# EAGLE design Shematic (EAGLE 8.6.3)
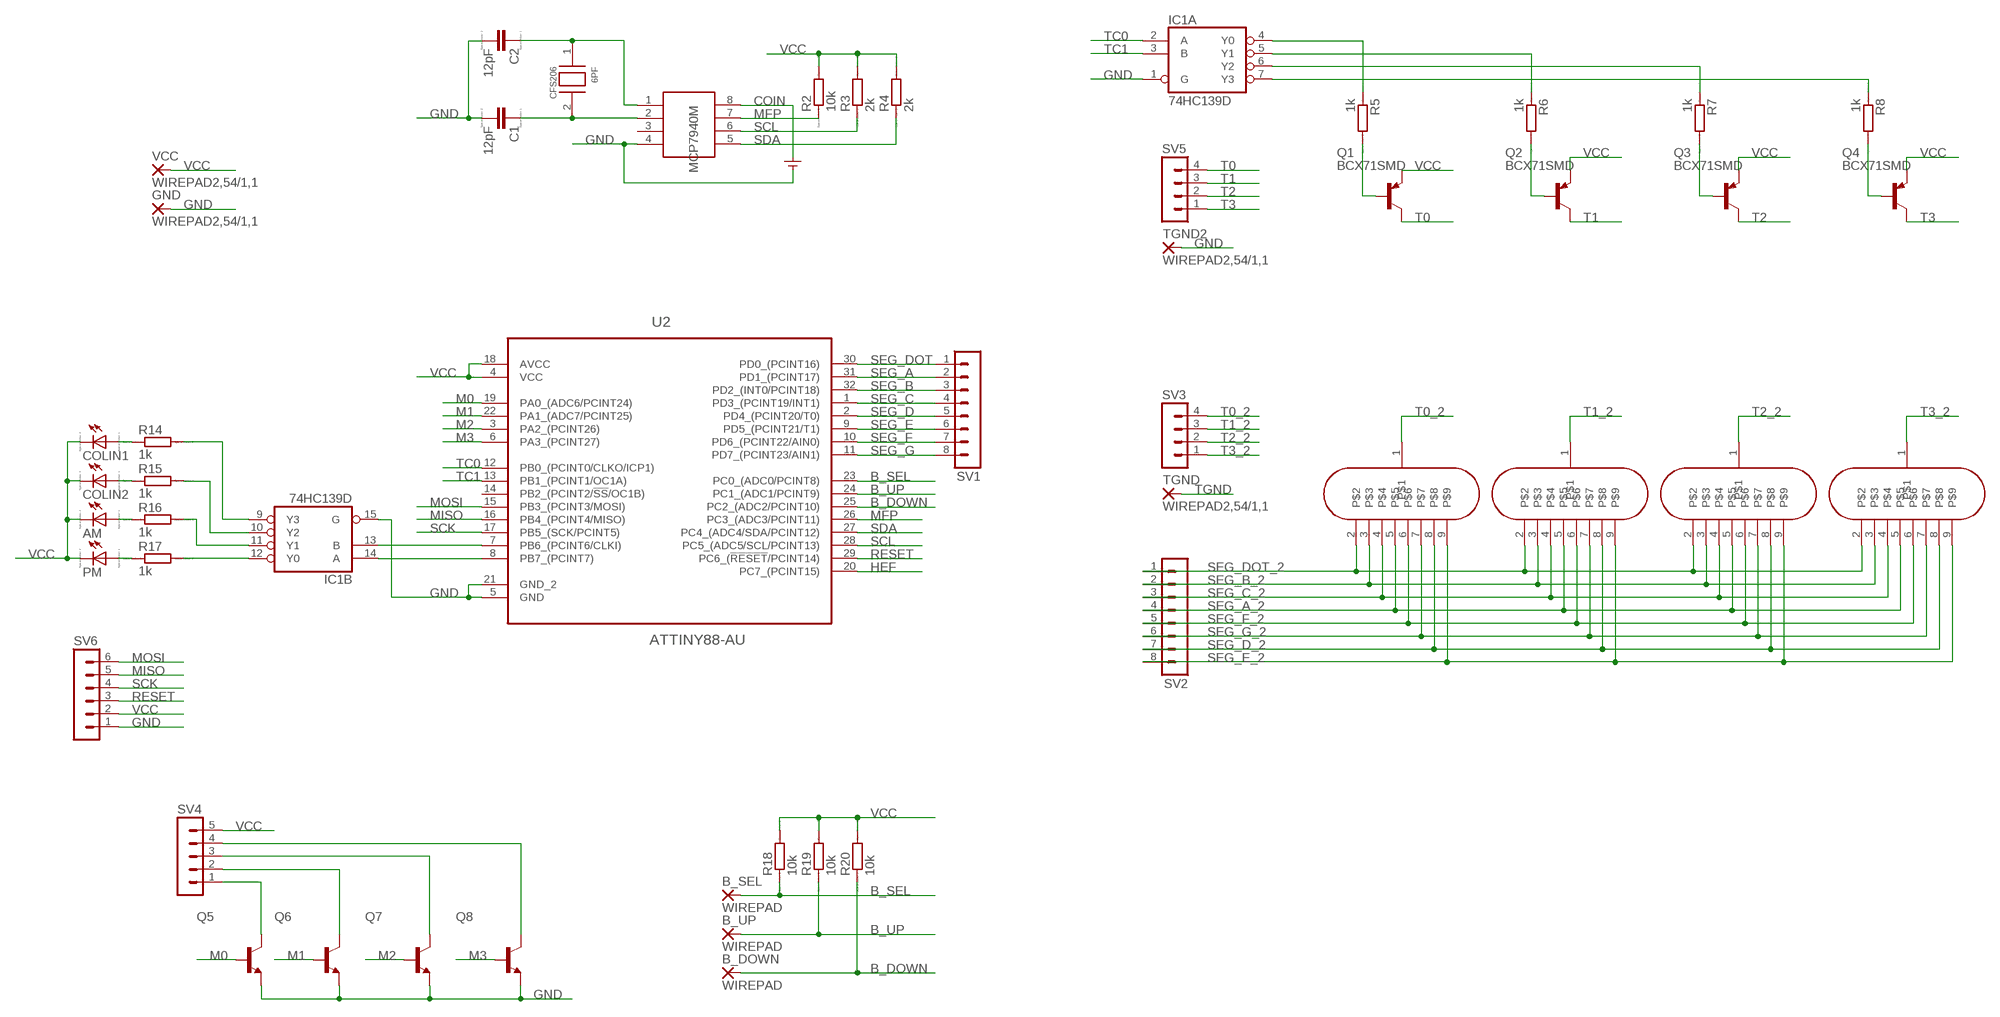
[diagram p0: schematic, sheet 1]

## Parts
6PF  CFS206  [CFS206]
AM  LED_ELD260  [LED_LD260]
B_DOWN  WIREPAD  WIREPAD2,54/1,1  [2,54/1,1]
B_SEL  WIREPAD  WIREPAD2,54/1,1  [2,54/1,1]
B_UP  WIREPAD  WIREPAD2,54/1,1  [2,54/1,1]
C1  12pF  CC1206  [C1206]
C2  12pF  CC1206  [C1206]
COLIN1  LED_ELD260  [LED_LD260]
COLIN2  LED_ELD260  [LED_LD260]
GND  WIREPAD2,54/1,1  [2,54/1,1]
IC1  74HC139D  [SO16]
MCP7940M  SOIC-8  [SOIC-8]
PM  LED_ELD260  [LED_LD260]
Q1  BCX71SMD  [SOT23]
Q2  BCX71SMD  [SOT23]
Q3  BCX71SMD  [SOT23]
Q4  BCX71SMD  [SOT23]
Q5  BCX70SMD  [SOT23]
Q6  BCX70SMD  [SOT23]
Q7  BCX70SMD  [SOT23]
Q8  BCX70SMD  [SOT23]
R2  10k  RR1206  [R1206]
R3  2k  RR1206  [R1206]
R4  2k  RR1206  [R1206]
R5  1k  RR1206  [R1206]
R6  1k  RR1206  [R1206]
R7  1k  RR1206  [R1206]
R8  1k  RR1206  [R1206]
R14  1k  RR1206  [R1206]
R15  1k  RR1206  [R1206]
R16  1k  RR1206  [R1206]
R17  1k  RR1206  [R1206]
R18  10k  RR1206  [R1206]
R19  10k  RR1206  [R1206]
R20  10k  RR1206  [R1206]
SV1  MA08-1  [MA08-1]
SV2  MA08-1  [MA08-1]
SV3  MA04-1  [MA04-1]
SV4  MA05-1  [MA05-1]
SV5  MA04-1  [MA04-1]
SV6  MA06-1  [MA06-1]
TGND  WIREPAD2,54/1,1  [2,54/1,1]
TGND2  WIREPAD2,54/1,1  [2,54/1,1]
TUBE0  IV-9  [IV-9]
TUBE1  IV-9  [IV-9]
TUBE2  IV-9  [IV-9]
TUBE3  IV-9  [IV-9]
U2  ATTINY88-AU  [QFP80P900X900X120-32N]
U$5  COIN  [COIN]
VCC  WIREPAD2,54/1,1  [2,54/1,1]

## Nets
B_DOWN: B_DOWN.1(P) R20.1 U2.25(PC2_(ADC2/PCINT10))
B_SEL: B_SEL.1(P) R18.1 U2.23(PC0_(ADC0/PCINT8))
B_UP: B_UP.1(P) R19.1 U2.24(PC1_(ADC1/PCINT9))
COIN: MCP7940M.8 U$5.V+
GND: C1.2 C2.2 GND.1(P) IC1.1(A:G) IC1.15(B:G) MCP7940M.4 Q5.2(E) Q6.2(E) Q7.2(E) Q8.2(E) SV6.1 TGND2.1(P) U2.5(GND) U2.21(GND_2) U$5.V-
HEF: U2.20(PC7_(PCINT15))
M0: Q5.1(B) U2.19(PA0_(ADC6/PCINT24))
M1: Q6.1(B) U2.22(PA1_(ADC7/PCINT25))
M2: Q7.1(B) U2.3(PA2_(PCINT26))
M3: Q8.1(B) U2.6(PA3_(PCINT27))
MFP: MCP7940M.7 R2.1 U2.26(PC3_(ADC3/PCINT11))
MISO: SV6.5 U2.16(PB4_(PCINT4/MISO))
MOSI: SV6.6 U2.15(PB3_(PCINT3/MOSI))
N$1: Q4.1(B) R8.2
N$2: Q3.1(B) R7.2
N$3: Q2.1(B) R6.2
N$4: 6PF.2 C1.1 MCP7940M.2
N$5: Q1.1(B) R5.2
N$6: 6PF.1 C2.1 MCP7940M.1
N$7: COLIN1.A R14.1
N$8: IC1.4(A:Y0) R5.1
N$9: COLIN2.A R15.1
N$10: IC1.5(A:Y1) R6.1
N$11: IC1.6(A:Y2) R7.1
N$12: AM.A R16.1
N$13: IC1.7(A:Y3) R8.1
N$14: PM.A R17.1
N$15: IC1.12(B:Y0) R17.2
N$16: IC1.11(B:Y1) R16.2
N$17: IC1.10(B:Y2) R15.2
N$18: IC1.9(B:Y3) R14.2
N$19: Q5.3(C) SV4.1
N$20: Q6.3(C) SV4.2
N$21: Q7.3(C) SV4.3
N$22: Q8.3(C) SV4.4
N$27: IC1.13(B:B) U2.7(PB6_(PCINT6/CLKI))
N$28: IC1.14(B:A) U2.8(PB7_(PCINT7))
RESET: SV6.3 U2.29(PC6_(!RESET!/PCINT14))
SCK: SV6.4 U2.17(PB5_(SCK/PCINT5))
SCL: MCP7940M.6 R3.1 U2.28(PC5_(ADC5/SCL/PCINT13))
SDA: MCP7940M.5 R4.1 U2.27(PC4_(ADC4/SDA/PCINT12))
SEG_A: SV1.2 U2.31(PD1_(PCINT17))
SEG_A_2: SV2.4 TUBE0.5 TUBE1.5 TUBE2.5 TUBE3.5
SEG_B: SV1.3 U2.32(PD2_(INT0/PCINT18))
SEG_B_2: SV2.2 TUBE0.3 TUBE1.3 TUBE2.3 TUBE3.3
SEG_C: SV1.4 U2.1(PD3_(PCINT19/INT1))
SEG_C_2: SV2.3 TUBE0.4 TUBE1.4 TUBE2.4 TUBE3.4
SEG_D: SV1.5 U2.2(PD4_(PCINT20/T0))
SEG_D_2: SV2.7 TUBE0.8 TUBE1.8 TUBE2.8 TUBE3.8
SEG_DOT: SV1.1 U2.30(PD0_(PCINT16))
SEG_DOT_2: SV2.1 TUBE0.2 TUBE1.2 TUBE2.2 TUBE3.2
SEG_E: SV1.6 U2.9(PD5_(PCINT21/T1))
SEG_E_2: SV2.8 TUBE0.9 TUBE1.9 TUBE2.9 TUBE3.9
SEG_F: SV1.7 U2.10(PD6_(PCINT22/AIN0))
SEG_F_2: SV2.5 TUBE0.6 TUBE1.6 TUBE2.6 TUBE3.6
SEG_G: SV1.8 U2.11(PD7_(PCINT23/AIN1))
SEG_G_2: SV2.6 TUBE0.7 TUBE1.7 TUBE2.7 TUBE3.7
T0: Q1.3(C) SV5.4
T0_2: SV3.4 TUBE0.1
T1: Q2.3(C) SV5.3
T1_2: SV3.3 TUBE1.1
T2: Q3.3(C) SV5.2
T2_2: SV3.2 TUBE2.1
T3: Q4.3(C) SV5.1
T3_2: SV3.1 TUBE3.1
TC0: IC1.2(A:A) U2.12(PB0_(PCINT0/CLKO/ICP1))
TC1: IC1.3(A:B) U2.13(PB1_(PCINT1/OC1A))
TGND: TGND.1(P)
VCC: AM.K(C) COLIN1.K(C) COLIN2.K(C) PM.K(C) Q1.2(E) Q2.2(E) Q3.2(E) Q4.2(E) R2.2 R3.2 R4.2 R18.2 R19.2 R20.2 SV4.5 SV6.2 U2.4(VCC) U2.18(AVCC) VCC.1(P)
Unconnected: MCP7940M.3 U2.14(PB2_(PCINT2/!SS!/OC1B))

## Power pins joined to a net without a drawn wire
GND: IC1.8(P:GND)
VCC: IC1.16(P:VCC)

## Library data of the parts
6PF = Library:CFS206
AM COLIN1 COLIN2 PM = eagle-ltspice:LED_E: LED Source: http://www.osram.convergy.de Source: www.luxeon.com Source: www.kingbright.com; SPICEMODEL: NONE; SPICEPREFIX: D; SPICETYPE: diode
B_DOWN B_SEL B_UP GND TGND TGND2 VCC = wirepad:WIREPAD: Wire PAD connect wire on PCB
C1 C2 = eagle-ltspice:C: CAPACITOR, European symbol; SPICEMODEL: NONE; SPICEPREFIX: C
IC1 = 74xx-eu:74*139: Dual 2-line to 4-line DECODER/DEMULTIPLEXER
MCP7940M = smd-footprints:SOIC-8
Q1-Q4 = transistor-pnp:BCX71SMD: PNP Transistor
Q5-Q8 = transistor-npn:BCX70*: NPN Transistor
R2-R8 R14-R20 = eagle-ltspice:R: RESISTOR, European symbol; SPICEMODEL: NONE; SPICEPREFIX: R
SV1 SV2 = con-lstb:MA08-1: PIN HEADER; OC_FARNELL: unknown; OC_NEWARK: unknown
SV3 SV5 = con-lstb:MA04-1: PIN HEADER; OC_FARNELL: unknown; OC_NEWARK: unknown
SV4 = con-lstb:MA05-1: PIN HEADER; OC_FARNELL: unknown; OC_NEWARK: unknown
SV6 = con-lstb:MA06-1: PIN HEADER; OC_FARNELL: unknown; OC_NEWARK: unknown
TUBE0 TUBE1-TUBE3 = Library:IV-9
U2 = Library:ATTINY88-AU: IC, 8BIT MCU, AVR Tiny, 12MHZ, TQFP-32; MPN: ATTINY88-AU; OC_FARNELL: 1704570; OC_NEWARK: 68T3851; PACKAGE: TQFP-32; SUPPLIER: ATMEL
U$5 = Library:COIN

## Board
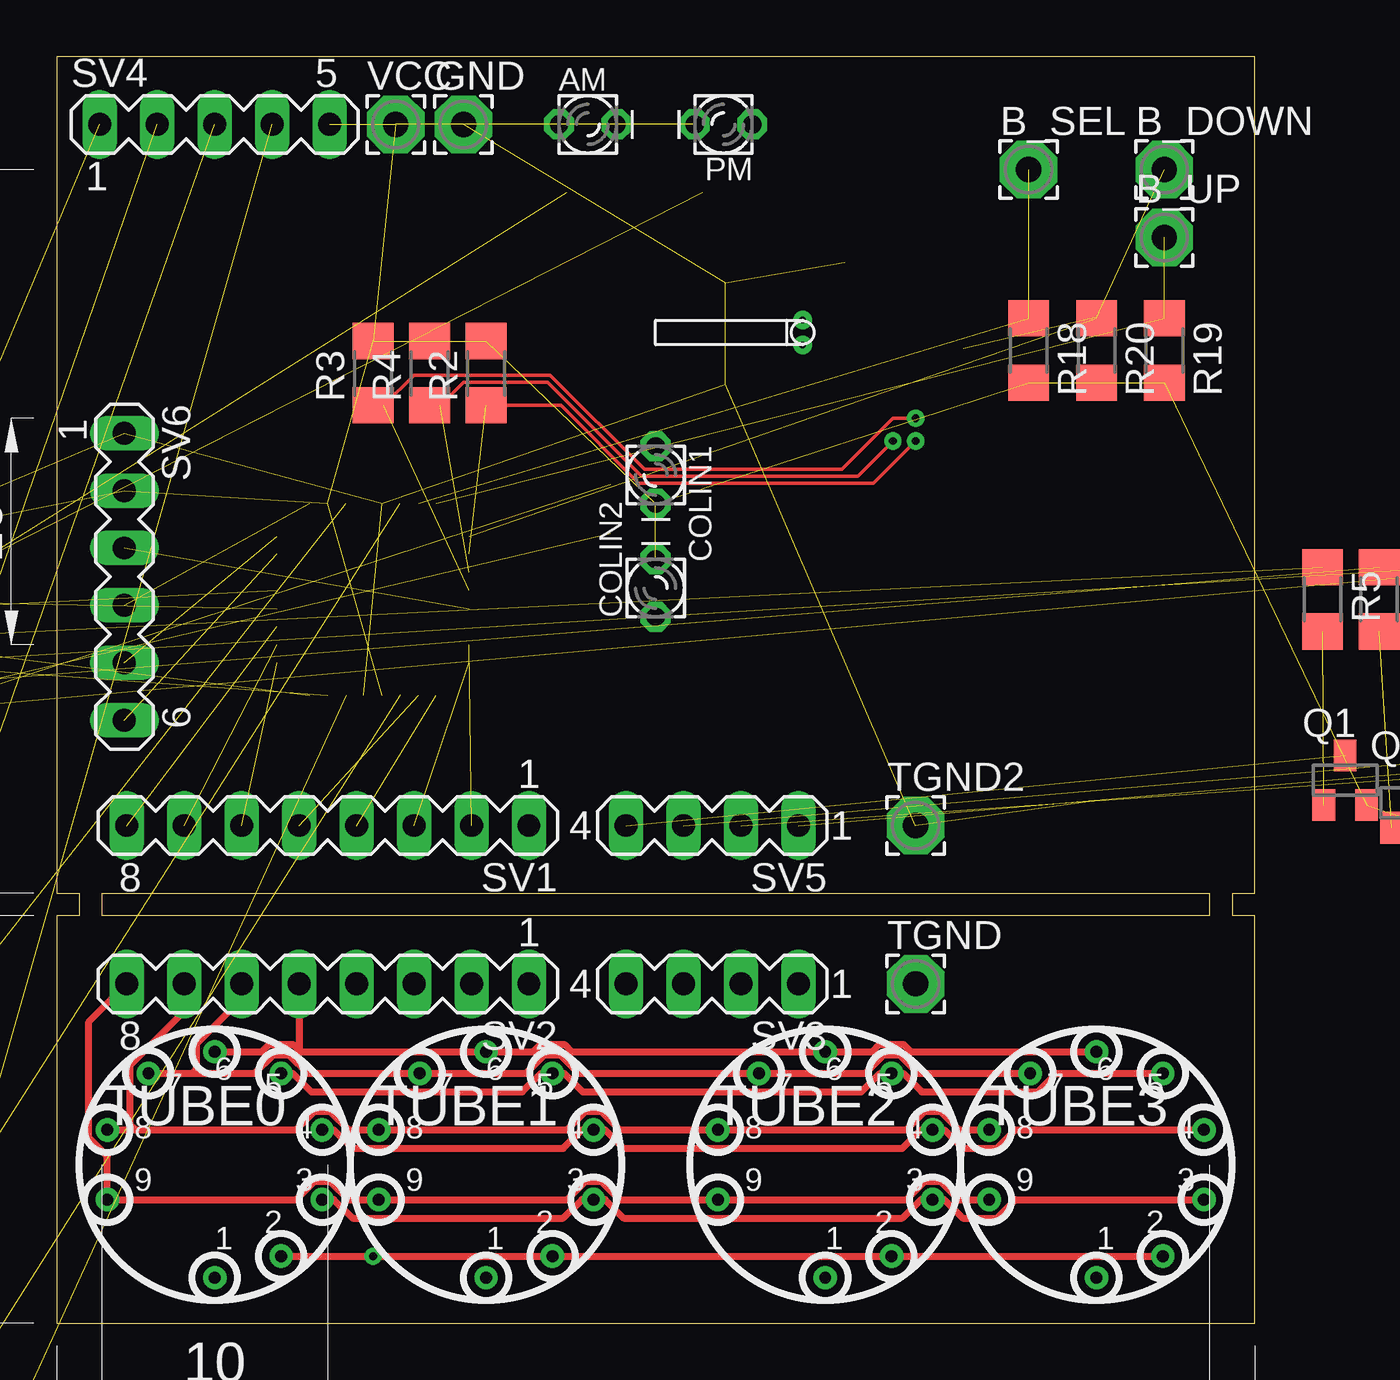
[diagram p1: board, top side]
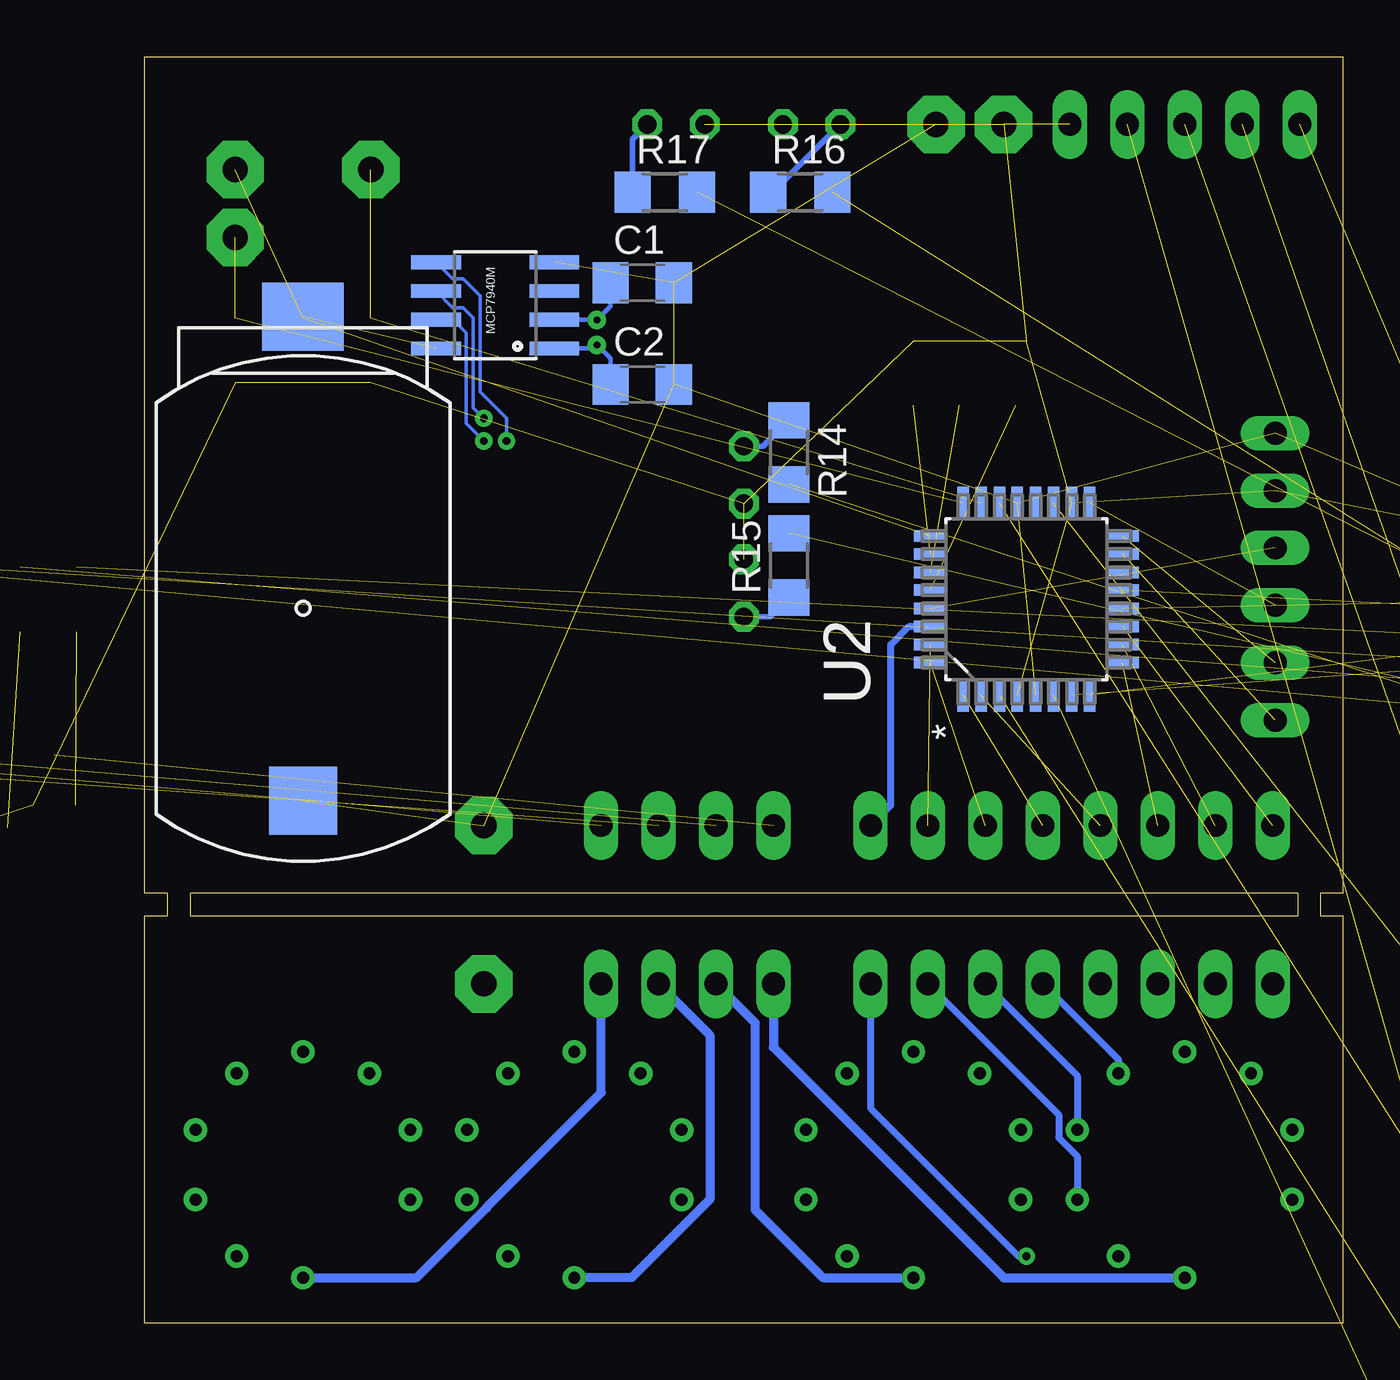
[diagram p2: board, bottom side, seen from below]

Size 53 x 56 mm. Coordinates in mm from the lower left corner, seen from the top.
Outline: 0,0 53,0 53,18 52,18 52,19 53,19 53,56 0,56 0,19 1,19 1,18 0,18 0,0
Outline: 51,18 2,18 2,19 51,19 51,18
Copper layers (1*16): Top 0.035mm / dielectric 1.5mm / Bottom 0.035mm
Design rules "default": minimum track width 6mil, minimum drill 0.35mm, track to track 6mil, track to pad 6mil, pad to pad 6mil, via to via 6mil, smd to smd 6mil, copper to edge 40mil, drill to drill 6mil, minimum pad ring 10mil, minimum via ring 8mil, stop-mask expansion 4mil, vias tented up to drill 0mil, thermal gap 10mil
Holes 3 mm at 100,-6 100,20

### Footprints (pad centres in the part's own frame; a part is rotated, then mirrored left to right if it is on the bottom)
CFS206 = drill 0.3: 1 0,0; 2 1.1,0
LED_LD260 = drill 0.813 octagon: A -1.27,0; K 1.27,0
2,54/1,1 = drill 1.118 pad 2.54 octagon: 1 0,0
C1206 = smd 1.6 x 1.8: 1 -1.4,0; 2 1.4,0
SO16 = smd 0.66 x 2.032: 1 -4.445,-3.073; 2 -3.175,-3.073; 3 -1.905,-3.073; 4 -0.635,-3.073; 5 0.635,-3.073; 6 1.905,-3.073; 7 3.175,-3.073; 8 4.445,-3.073; 9 4.445,3.073; 10 3.175,3.073; 11 1.905,3.073; 12 0.635,3.073; 13 -0.635,3.073; 14 -1.905,3.073; 15 -3.175,3.073; 16 -4.445,3.073
SOIC-8 = smd 0.61 x 2.21: 1 -1.905,-2.616; 2 -0.635,-2.616; 3 0.635,-2.616; 4 1.905,-2.616; 5 1.905,2.616; 6 0.635,2.616; 7 -0.635,2.616; 8 -1.905,2.616
SOT23 = smd 1 x 1.4: 1 -0.95,-1.1; 2 0.95,-1.1; 3 0,1.1
R1206 = smd 1.6 x 1.803: 1 -1.422,0; 2 1.422,0
MA08-1 = drill 1.016 long: 1 -8.89,0; 2 -6.35,0; 3 -3.81,0; 4 -1.27,0; 5 1.27,0; 6 3.81,0; 7 6.35,0; 8 8.89,0
MA04-1 = drill 1.016 long: 1 -3.81,0; 2 -1.27,0; 3 1.27,0; 4 3.81,0
MA05-1 = drill 1.016 long: 1 -5.08,0; 2 -2.54,0; 3 0,0; 4 2.54,0; 5 5.08,0
MA06-1 = drill 1.016 long: 1 -6.35,0; 2 -3.81,0; 3 -1.27,0; 4 1.27,0; 5 3.81,0; 6 6.35,0
IV-9 = drill 0.525: 1 0,-4.994; 2 2.936,-4.041; 3 4.75,-1.543; 4 4.75,1.543; 5 2.936,4.041; 6 0,4.994; 7 -2.936,4.041; 8 -4.75,1.543; 9 -4.75,-1.543
QFP80P900X900X120-32N = smd 1.473 x 0.508: 1 -4.242,2.794; 2 -4.242,2.007; 3 -4.242,1.194; 4 -4.242,0.406; 5 -4.242,-0.406; 6 -4.242,-1.194; 7 -4.242,-2.007; 8 -4.242,-2.794; 17 4.242,-2.794; 18 4.242,-2.007; 19 4.242,-1.194; 20 4.242,-0.406; 21 4.242,0.406; 22 4.242,1.194; 23 4.242,2.007; 24 4.242,2.794 | smd 0.508 x 1.473: 9 -2.794,-4.242; 10 -2.007,-4.242; 11 -1.194,-4.242; 12 -0.406,-4.242; 13 0.406,-4.242; 14 1.194,-4.242; 15 2.007,-4.242; 16 2.794,-4.242; 25 2.794,4.242; 26 2.007,4.242; 27 1.194,4.242; 28 0.406,4.242; 29 -0.406,4.242; 30 -1.194,4.242; 31 -2.007,4.242; 32 -2.794,4.242
COIN = smd 3.6 x 3: V+ 0,-1.5 | smd 3 x 3: V- 0,19.9

### Placement (x,y rotation side)
6PF  33,43.25 90 top
AM  23.5,53 0 top
B_DOWN  49,51 0 top
B_SEL  43,51 0 top
B_UP  49,48 0 top
C1  31,46 0 bottom
C2  31,41.5 0 bottom
COLIN1  26.5,37.5 270 top
COLIN2  26.5,32.5 90 top
GND  18,53 0 top
IC1  -17,29 270 top  (outside the outline)
MCP7940M  37.5,45 90 bottom
PM  29.5,53 180 top
Q1  57,24 0 top  (outside the outline)
Q2  64,24 0 top  (outside the outline)
Q3  60,23 0 top  (outside the outline)
Q4  69,24 0 top  (outside the outline)
Q5  -25,-12 0 top  (outside the outline)
Q6  -21,-21 0 top  (outside the outline)
Q7  -23,-33 0 top  (outside the outline)
Q8  -15,-34 0 top  (outside the outline)
R2  19,42 90 top
R3  14,42 90 top
R4  16.5,42 90 top
R5  56,32 270 top
R6  61.5,32 270 top  (outside the outline)
R7  58.5,32 270 top  (outside the outline)
R8  64.5,32 270 top  (outside the outline)
R14  24.5,38.5 270 bottom
R15  24.5,33.5 90 bottom
R16  24,50 0 bottom
R17  30,50 0 bottom
R18  43,43 270 top
R19  49,43 270 top
R20  46,43 270 top
SV1  12,22 180 top
SV2  12,15 180 top
SV3  29,15 180 top
SV4  7,53 0 top
SV5  29,22 180 top
SV6  3,33 270 top
TGND  38,15 0 top
TGND2  38,22 0 top
TUBE0  7,7 0 top
TUBE1  19,7 0 top
TUBE2  34,7 0 top
TUBE3  46,7 0 top
U2  14,32 90 bottom
U$5  46,43 180 bottom
VCC  15,53 0 top

### Tracks (layer width: path | path; a pad name or v marks a point on that pad's centre or on a via)
B_DOWN  (2 unrouted)
B_SEL  (2 unrouted)
B_UP  (2 unrouted)
COIN  (1 unrouted)
GND  (15 unrouted)
M0  (1 unrouted)
M1  (1 unrouted)
M2  (1 unrouted)
M3  (1 unrouted)
MFP  (via drill 0.35)  (1 unrouted)
  Top 0.152: R2.1 22.31,40.58 25.75,37.14 36.14,37.14 v38,39
  Bottom 0.152: MCP7940M.7 39.37,44.37 38.78,43.78 38.78,39.78 v38,39
MISO  (1 unrouted)
MOSI  (1 unrouted)
N$1  (1 unrouted)
N$2  (1 unrouted)
N$3  (1 unrouted)
N$4
  Bottom 0.203: MCP7940M.2 33.02,44.37 6PF.2 32.4,44.95 C1.1
N$5  (1 unrouted)
N$6
  Bottom 0.203: MCP7940M.1 33.16,43.09 6PF.1 32.4,42.65 C2.1
N$7
  Bottom 0.254: COLIN1.A 25.65,38.77 R14.1
N$8  (1 unrouted)
N$9
  Bottom 0.254: COLIN2.A 25.35,31.23 R15.1
N$10  (1 unrouted)
N$11  (1 unrouted)
N$12
  Bottom 0.254: AM.A 25.23,50 R16.1
N$13  (1 unrouted)
N$14
  Bottom 0.254: PM.A 31.42,52.35 R17.1
N$15  (1 unrouted)
N$16  (1 unrouted)
N$17  (1 unrouted)
N$18  (1 unrouted)
N$19  (1 unrouted)
N$20  (1 unrouted)
N$21  (1 unrouted)
N$22  (1 unrouted)
N$27  (1 unrouted)
N$28  (1 unrouted)
RESET  (1 unrouted)
SCK  (1 unrouted)
SCL  (via drill 0.35)  (1 unrouted)
  Top 0.152: R3.1 14.47,40.58 15.81,41.91 21.84,41.91 26,37.75 34.75,37.75 37,40 v38,40
  Bottom 0.152: MCP7940M.6 39.38,44.9 38.92,44.9 38.48,44.46 38.48,40.48 v38,40
SDA  (via drill 0.35)  (1 unrouted)
  Top 0.152: R4.1 16.98,40.58 18,41.61 21.71,41.61 25.87,37.45 35.45,37.45 v37,39
  Bottom 0.152: MCP7940M.5 39.38,46.17 38.92,46.17 38.17,45.42 38.17,41.17 37,40 v37,39
SEG_A  (1 unrouted)
SEG_A_2
  Top 0.305: TUBE0.5 10.45,11.04 11.27,10.22 20.6,10.22 21.42,11.04 TUBE1.5 22.45,11.04 23.27,10.22 35.6,10.22 36.42,11.04 TUBE2.5 37.45,11.04 38.27,10.22 43.4,10.22 44.23,11.04 TUBE3.5
  Bottom 0.305: SV2.4 9.94,11.67 TUBE0.5
SEG_B  (1 unrouted)
SEG_B_2
  Top 0.305: TUBE0.3 12.27,5.46 13.09,4.63 22.41,4.63 23.23,5.46 TUBE1.3 24.27,5.46 25.09,4.63 37.41,4.63 38.23,5.46 TUBE2.3 39.27,5.46 40.09,4.63 41.59,4.63 42.41,5.46 TUBE3.3
  Bottom 0.305: TUBE0.3 11.75,7.38 12.57,8.2 12.57,9.22 SV2.2
SEG_C  (1 unrouted)
SEG_C_2
  Top 0.305: TUBE0.4 12.27,8.54 13.09,7.72 22.41,7.72 23.23,8.54 TUBE1.4 24.27,8.54 25.09,7.72 37.41,7.72 38.23,8.54 TUBE2.4 39.27,8.54 40.09,7.72 41.59,7.72 42.41,8.54 TUBE3.4
  Bottom 0.305: SV2.3 11.75,10.94 TUBE0.4
SEG_D  (1 unrouted)
SEG_D_2
  Top 0.305: TUBE0.8 3.5,8.54 | 3.5,8.54 10.59,8.54 11.41,9.37 12.09,9.37 12.91,8.54 TUBE1.8 22.59,8.54 23.41,9.37 24.09,9.37 24.91,8.54 TUBE2.8 37.59,8.54 38.41,9.37 39.09,9.37 39.91,8.54 TUBE3.8 | SV2.7 5.65,13.79 3.24,11.38 3.24,8.8 3.5,8.54
SEG_DOT
  Bottom 0.305: SV1.1 20,22.89 20,30 19.19,30.81 U2.30
SEG_DOT_2  (via drill 0.35)
  Top 0.305: TUBE0.2 v14,2.96 TUBE1.2 TUBE2.2 TUBE3.2
  Bottom 0.305: SV2.1 20.89,9.5 14.35,2.96 v14,2.96
SEG_E  (1 unrouted)
SEG_E_2
  Top 0.305: TUBE3.9 39.91,5.46 39.09,6.28 38.41,6.28 37.59,5.46 TUBE2.9 24.91,5.46 24.09,6.28 23.41,6.28 22.59,5.46 TUBE1.9 12.91,5.46 12.09,6.28 11.41,6.28 10.59,5.46 TUBE0.9 2.25,7.38 1.43,8.2 1.43,13.32 SV2.8
SEG_F  (1 unrouted)
SEG_F_2
  Top 0.305: TUBE0.6 9.08,11.99 9.41,12.32 10.46,12.32 10.73,12.05 | TUBE3.6 37.79,11.99 37.47,12.32 36.41,12.32 36.08,11.99 TUBE2.6 22.79,11.99 22.46,12.32 21.41,12.32 21.08,11.99 TUBE1.6 10.79,11.99 10.73,12.05 | SV2.5 10.73,12.05
SEG_G  (1 unrouted)
SEG_G_2
  Top 0.305: TUBE0.7 6,11.04 | 6,11.04 8.77,11.04 9.6,11.86 10.28,11.86 11.1,11.04 TUBE1.7 20.77,11.04 21.6,11.86 22.28,11.86 23.1,11.04 TUBE2.7 35.77,11.04 36.6,11.86 37.28,11.86 38.1,11.04 TUBE3.7 | SV2.6 8.19,14.35 6.18,12.34 6.18,11.22 6,11.04
T0  (1 unrouted)
T0_2
  Bottom 0.406: SV3.4 25.19,12.19 15,2 14.99,2.01 TUBE0.1
T1  (1 unrouted)
T1_2
  Bottom 0.406: SV3.3 26,13.27 26,5 23.01,2.01 TUBE1.1
T2  (1 unrouted)
T2_2
  Bottom 0.406: SV3.2 28,12.73 28,5.47 31.47,2.01 TUBE2.1
T3  (1 unrouted)
T3_2
  Bottom 0.406: TUBE3.1 40.97,2.01 37.88,5.09 37.88,5.12 32.81,10.19 SV3.1
TC0  (1 unrouted)
TC1  (1 unrouted)
VCC  (19 unrouted)

### Text on the board
tPlace: Bottom
bPlace: Top